# EAGLE design 01 (EAGLE 7.2.0)
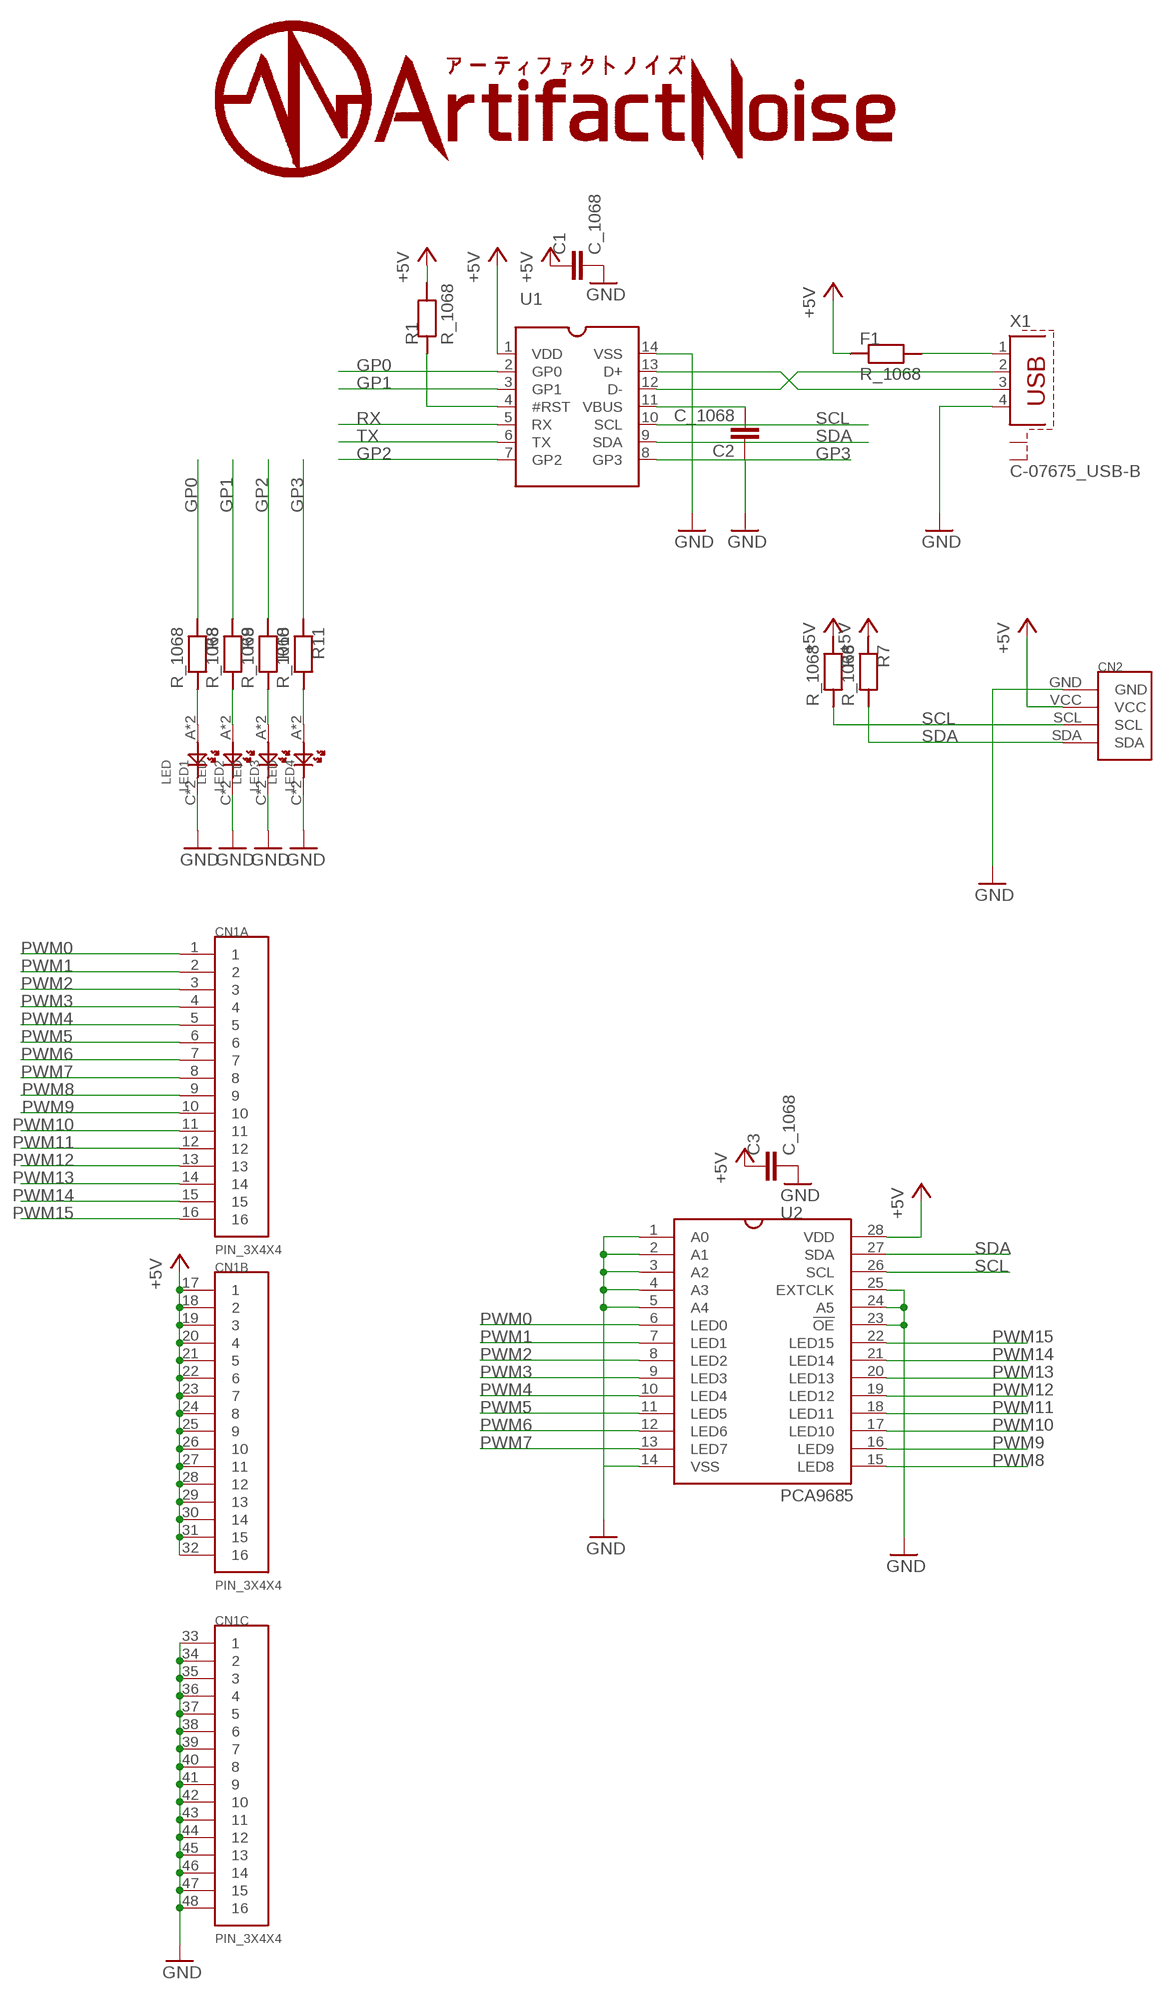
[diagram p0: schematic, sheet 1]

## Parts
C1  C_1068  [C0603]
C2  C_1068  [C0603]
C3  C_1068  [C0603]
CN1  PIN_3X4X4  [PIN_3X4X4]
CN2  PIN4  [PIN4]
F1  R_1068  [R0603]
LED1  LED  [CHIPLED_0805]
LED2  LED  [CHIPLED_0805]
LED3  LED  [CHIPLED_0805]
LED4  LED  [CHIPLED_0805]
R1  R_1068  [R0603]
R6  R_1068  [R0603]
R7  R_1068  [R0603]
R8  R_1068  [R0603]
R9  R_1068  [R0603]
R10  R_1068  [R0603]
R11  R_1068  [R0603]
U1  _MCP2221A-I/PS  [SOCKET-14]
U2  PCA9685  [TSSOP28]
X1  C-07675_USB-B  [PN61729-S]

## Nets
+5V: C1.1 C1.D1 C3.1 C3.D1 CN1.17 CN1.18 CN1.19 CN1.20 CN1.21 CN1.22 CN1.23 CN1.24 CN1.25 CN1.26 CN1.27 CN1.28 CN1.29 CN1.30 CN1.31 CN1.32 CN2.VCC F1.1 F1.D1 R1.2 R1.D2 R6.1 R6.D1 R7.1 R7.D1 U1.1(VDD) U2.28(VDD)
GND: C1.2 C1.D2 C2.1 C2.D1 C3.2 C3.D2 CN1.33 CN1.34 CN1.35 CN1.36 CN1.37 CN1.38 CN1.39 CN1.40 CN1.41 CN1.42 CN1.43 CN1.44 CN1.45 CN1.46 CN1.47 CN1.48 CN2.GND LED1.C LED1.DC(C) LED2.C LED2.DC(C) LED3.C LED3.DC(C) LED4.C LED4.DC(C) U1.14(VSS) U2.1(A0) U2.2(A1) U2.3(A2) U2.4(A3) U2.5(A4) U2.14(VSS) U2.23(!OE) U2.24(A5) U2.25(EXTCLK) X1.4
GP0: R8.1 R8.D1 U1.2(GP0)
GP1: R9.1 R9.D1 U1.3(GP1)
GP2: R10.1 R10.D1 U1.7(GP2)
GP3: R11.1 R11.D1 U1.8(GP3)
N$1: R1.1 R1.D1 U1.4(#RST)
N$2: U1.13(D+) X1.3
N$3: U1.12(D-) X1.2
N$4: C2.2 C2.D2 U1.11(VBUS)
N$5: F1.2 F1.D2 X1.1
N$9: LED1.A LED1.DA(A) R8.2 R8.D2
N$10: LED2.A LED2.DA(A) R9.2 R9.D2
N$11: LED3.A LED3.DA(A) R10.2 R10.D2
N$12: LED4.A LED4.DA(A) R11.2 R11.D2
PWM0: CN1.1 U2.6(LED0)
PWM1: CN1.2 U2.7(LED1)
PWM2: CN1.3 U2.8(LED2)
PWM3: CN1.4 U2.9(LED3)
PWM4: CN1.5 U2.10(LED4)
PWM5: CN1.6 U2.11(LED5)
PWM6: CN1.7 U2.12(LED6)
PWM7: CN1.8 U2.13(LED7)
PWM8: CN1.9 U2.15(LED8)
PWM9: CN1.10 U2.16(LED9)
PWM10: CN1.11 U2.17(LED10)
PWM11: CN1.12 U2.18(LED11)
PWM12: CN1.13 U2.19(LED12)
PWM13: CN1.14 U2.20(LED13)
PWM14: CN1.15 U2.21(LED14)
PWM15: CN1.16 U2.22(LED15)
RX: U1.5(RX)
SCL: CN2.SCL R6.2 R6.D2 U1.10(SCL) U2.26(SCL)
SDA: CN2.SDA R7.2 R7.D2 U1.9(SDA) U2.27(SDA)
TX: U1.6(TX)
Unconnected: X1.S1 X1.S2

## Library data of the parts
C1-C3 = 01:C_1068
CN1 = 01:PIN_3X4X4
CN2 = 01:PIN4
F1 R1 R6-R11 = 01:R_1068
LED1-LED4 = 01:LED
U1 = 01:_MCP2221A-I/P: Dual In Line / Socket
U2 = 01:PCA9685
X1 = 01:C-07675_USB-B: BERG USB connector; OC_FARNELL: unknown; OC_NEWARK: unknown

## Board
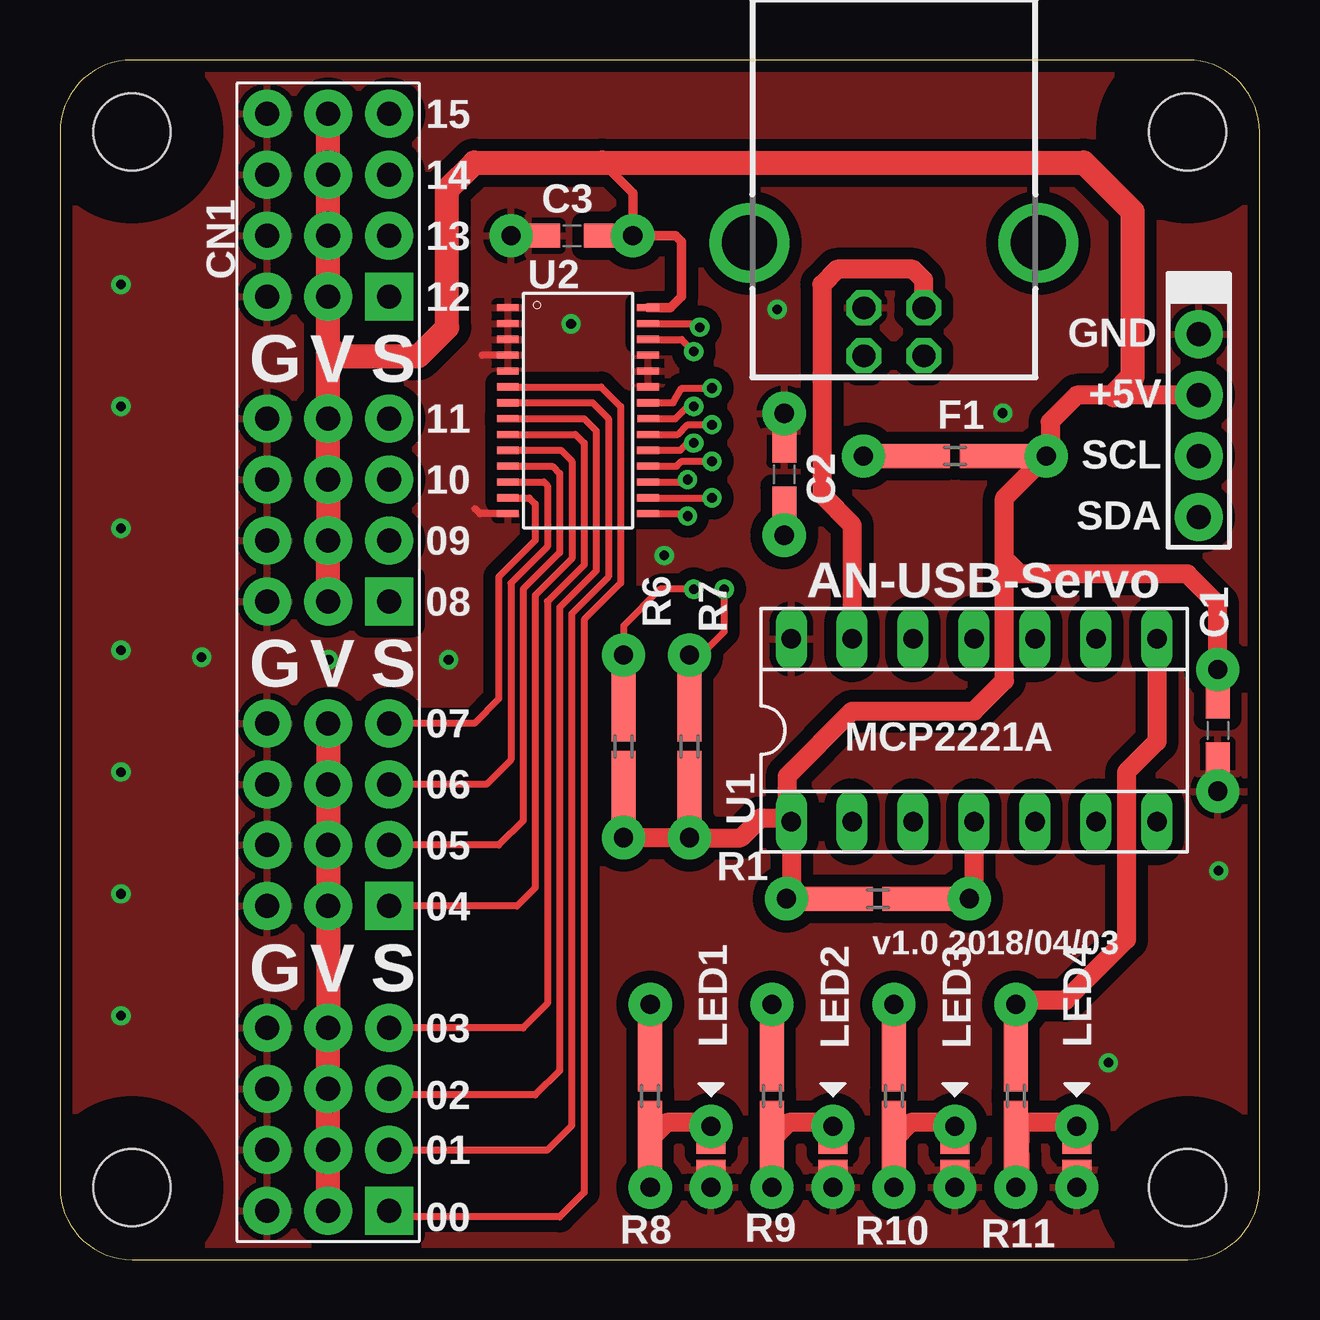
[diagram p1: board, top side]
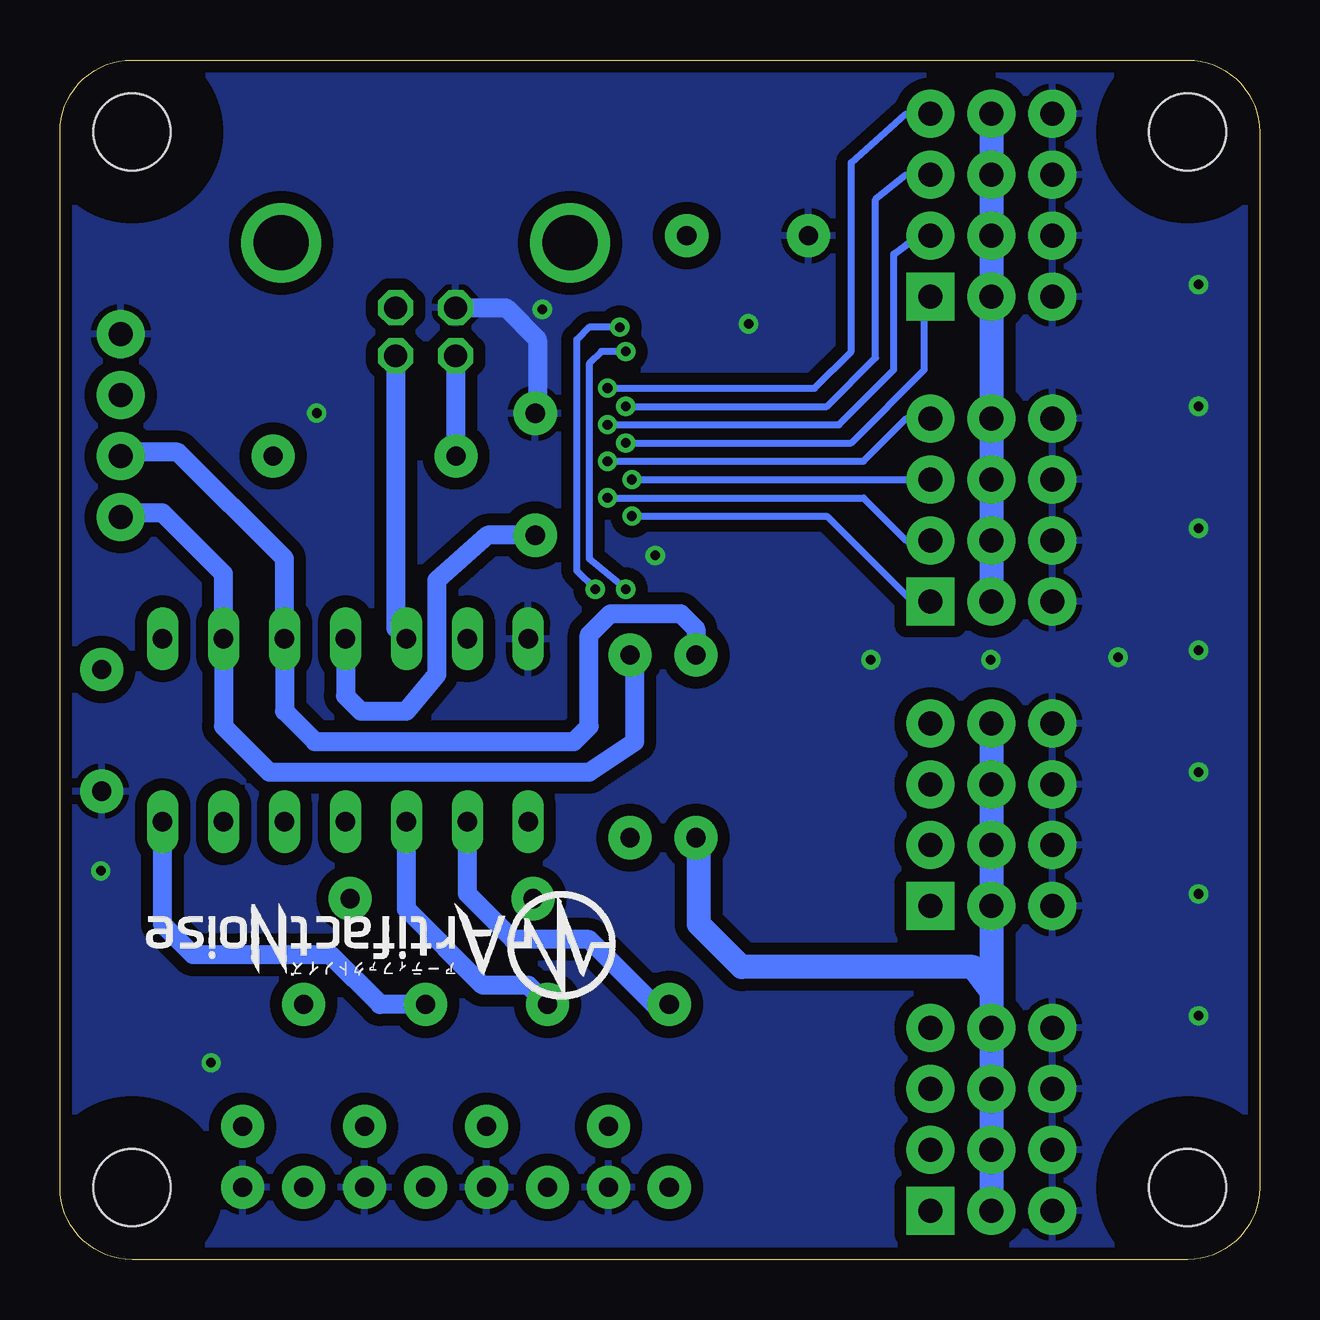
[diagram p2: board, bottom side, seen from below]

Size 50 x 50 mm. Coordinates in mm from the lower left corner, seen from the top.
Outline: 50,3 50,47 arc90 47,50 3,50 arc90 0,47 0,3 arc90 3,0 47,0 arc90 50,3
Copper layers (1*16): Top 0.035mm / dielectric 1.5mm / Bottom 0.035mm
Design rules "SeeedStudio_2layer_DRU_no_angle_20140221a": minimum track width 6mil, minimum drill 12mil, track to track 6mil, track to pad 6mil, pad to pad 6mil, via to via 6mil, smd to smd 0mil, copper to edge 10mil, drill to drill 10mil, minimum pad ring 10mil, minimum via ring 6mil, stop-mask expansion 2mil, vias tented up to drill 25mil, thermal gap 10mil
Holes 3.2 mm at 47,47 3,47 3,3 47,3
tRestrict: area -0.2,-0.2 to 6.2,6.2; area -0.2,43.8 to 6.2,50.2; area 43.8,43.8 to 50.2,50.2; area 43.8,-0.2 to 50.2,6.2
bRestrict: area 43.8,-0.2 to 50.2,6.2; area 43.8,43.8 to 50.2,50.2; area -0.2,43.8 to 6.2,50.2; area -0.2,-0.2 to 6.2,6.2

### Footprints (pad centres in the part's own frame; a part is rotated, then mirrored left to right if it is on the bottom)
C0603 = smd 2.6 x 1: 1 -1.8,0; 2 1.8,0 | drill 0.8 pad 1.8: D1 -2.54,0; D2 2.54,0
PIN_3X4X4 = drill 1 pad 2 square: 1 1.27,1.27; 5 13.97,1.27; 9 26.67,1.27; 13 39.37,1.27 | drill 1 pad 2: 2 3.81,1.27; 3 6.35,1.27; 4 8.89,1.27; 6 16.51,1.27; 7 19.05,1.27; 8 21.59,1.27; 10 29.21,1.27; 11 31.75,1.27; 12 34.29,1.27; 14 41.91,1.27; 15 44.45,1.27; 16 46.99,1.27; 17 1.27,3.81; 18 3.81,3.81; 19 6.35,3.81; 20 8.89,3.81; 21 13.97,3.81; 22 16.51,3.81; 23 19.05,3.81; 24 21.59,3.81; 25 26.67,3.81; 26 29.21,3.81; 27 31.75,3.81; 28 34.29,3.81; 29 39.37,3.81; 30 41.91,3.81; 31 44.45,3.81; 32 46.99,3.81; 33 1.27,6.35; 34 3.81,6.35; 35 6.35,6.35; 36 8.89,6.35; 37 13.97,6.35; 38 16.51,6.35; 39 19.05,6.35; 40 21.59,6.35; 41 26.67,6.35; 42 29.21,6.35; 43 31.75,6.35; 44 34.29,6.35; 45 39.37,6.35; 46 41.91,6.35; 47 44.45,6.35; 48 46.99,6.35
PIN4 = drill 1 pad 2: GND 0,-3.81; SCL 0,1.27; SDA 0,3.81; VCC 0,-1.27
R0603 = smd 3.2 x 1: 1 -1.8,0; 2 1.8,0 | drill 0.8 pad 1.8: D1 -3.81,0; D2 3.81,0
CHIPLED_0805 = smd 1.2 x 0.8: A 0,-1.8; C 0,-0.74 | drill 0.8 pad 1.8: DA 0,-2.54; DC 0,0
SOCKET-14 = drill 0.813 long: 1 -7.62,-3.81; 2 -5.08,-3.81; 3 -2.54,-3.81; 4 0,-3.81; 5 2.54,-3.81; 6 5.08,-3.81; 7 7.62,-3.81; 8 7.62,3.81; 9 5.08,3.81; 10 2.54,3.81; 11 0,3.81; 12 -2.54,3.81; 13 -5.08,3.81; 14 -7.62,3.81
TSSOP28 = smd 0.9 x 0.3: 1 -2.921,4.623; 2 -2.921,3.962; 3 -2.921,3.302; 4 -2.921,2.642; 5 -2.921,1.981; 6 -2.921,1.321; 7 -2.921,0.66; 8 -2.927,0; 9 -2.921,-0.66; 10 -2.921,-1.321; 11 -2.921,-1.981; 12 -2.921,-2.642; 13 -2.921,-3.302; 14 -2.921,-3.962; 15 2.921,-3.962; 16 2.921,-3.302; 17 2.921,-2.642; 18 2.921,-1.981; 19 2.921,-1.321; 20 2.921,-0.66; 21 2.927,0; 22 2.921,0.66; 23 2.921,1.321; 24 2.921,1.981; 25 2.921,2.642; 26 2.921,3.302; 27 2.921,3.962; 28 2.921,4.623
PN61729-S = drill 0.95 octagon: 1 1.25,4.71; 2 -1.25,4.71; 3 -1.25,2.71; 4 1.25,2.71 | drill 2.3 pad 2.9: S1 -6.02,0; S2 6.02,0

### Placement (x,y rotation side)
C1  48.26,22.06 270 top
C2  30.19,32.73 270 top
C3  21.34,42.67 180 top
CN1  14.99,0.76 90 top
CN2  47.46,34.76 180 top
F1  37.3,33.49 180 top
LED1  27.14,3.01 180 top
LED2  32.22,3.01 180 top
LED3  37.3,3.01 180 top
LED4  42.38,3.01 180 top
R1  34.09,15.04 180 top
R6  23.5,21.39 90 top
R7  26.23,21.39 90 top
R8  24.6,6.82 270 top
R9  29.68,6.82 270 top
R10  34.76,6.82 270 top
R11  39.84,6.82 270 top
U1  38.1,22.06 0 top
U2  21.59,35.05 0 top
U$1  [AN-LOGO2]  26.85,15.34 180 bottom
X1  34.76,42.38 180 top

### Tracks (layer width: path | path; a pad name or v marks a point on that pad's centre or on a via)
+5V
  Top 0.4: U2.28 25.45,39.67 25.91,40.13 25.91,42.42 25.65,42.67 C3.D1 | C3.D1 23.88,44.45 22.61,45.72 | C3.1 C3.D1
  Top 0.406: R6.1 R6.D1 | R7.1 R7.D1 | R1.2 R1.D2
  Top 0.8: F1.1 F1.D1 | CN2.VCC 43.94,36.03 42.38,36.03 41.27,34.92 41.27,33.66 F1.D1 | R1.D2 30.48,15.24 U1.1 30.32,18.41 | R6.D1 R7.D1 28.38,17.58 29.21,18.41 30.32,18.41 | C1.1 C1.D1 48.26,27.3 46.99,28.57 40.01,28.57 39.37,29.21 | 30.32,18.41 30.32,20.16 33.02,22.86 38.1,22.86 39.37,24.13 39.37,29.21 | 39.37,29.21 39.37,31.75 F1.D1
  Top 1: 43.94,36.03 44.7,36.79 44.7,43.69 42.67,45.72 22.61,45.72 17.27,45.72 16.14,44.59 16.14,38.85 14.92,37.64 11.7,37.64 11.18,38.06 | CN1.17 CN1.18 CN1.19 CN1.20 CN1.21 CN1.22 CN1.23 CN1.24 | CN1.25 CN1.26 CN1.27 CN1.28 11.18,38.06 | 11.18,38.06 CN1.29 CN1.30 CN1.31 CN1.32
  Bottom 1: 11.18,11.18 11.94,12.19 21.59,12.19 23.37,13.97 23.37,17.45 R6.D1 | CN1.32 CN1.31 CN1.30 CN1.29 CN1.25 | CN1.24 11.18,11.18 | 11.18,11.18 CN1.20 CN1.17
GND  (via drill 0.4 pad 0.8)
  Top 0.3: U2.4 17.61,37.69 17.6,37.7 | U2.14 17.51,31.09 17.3,31.3
  Top 0.8: LED4.C LED4.DC
  Bottom 0.8: X1.4 31.41,39.67 30.1,38.35 30.1,35.18 C2.D1
  other vias: 2.54,40.64 2.54,35.56 2.54,30.48 2.54,25.4 2.54,20.32 2.54,15.24 2.54,10.16 11.2,25 16.2,25 5.9,25.1 21.3,39 29.9,39.6 25.18,29.35 43.7,8.2 48.3,16.2 39.3,35.28
  pour Top (isolate 0.5): 51.27,-0.8 -0.8,-0.8 -0.8,51.27 51.27,51.27
  pour Bottom (isolate 0.5): 51.27,-0.8 -0.8,-0.8 -0.8,51.27 51.27,51.27
GP0
  Top 0.406: R8.1 R8.D1
  Bottom 0.8: R8.D1 25.23,10.63 27.94,13.34 31.11,13.34 33.02,15.24 U1.2
GP1
  Top 0.406: R9.1 R9.D1
  Bottom 0.8: R9.D1 30.48,11.43 32.38,11.43 35.56,14.61 U1.3
GP2
  Top 0.406: R10.1 R10.D1
  Bottom 0.8: R10.D1 36.66,10.63 38.73,12.7 44.45,12.7 45.72,13.97 U1.7
GP3
  Top 0.406: R11.1 R11.D1
  Top 0.8: U1.8 45.72,21.59 44.45,20.32 44.45,13.34 41.91,10.79 40.01,10.79 R11.D1
N$1
  Top 0.406: R1.1 R1.D1
  Top 0.8: U1.4 38.1,15.24 R1.D1
N$2
  Top 0.8: X1.3 36.01,40.83 35.56,41.27 32.38,41.27 31.75,40.64 31.75,31.88 33.02,30.61 U1.13
N$3
  Bottom 0.8: X1.2 36.01,26.32 U1.12
N$4
  Top 0.406: C2.D2 C2.2
  Bottom 0.8: U1.11 38.1,23.5 37.47,22.86 35.56,22.86 34.29,24.38 34.29,28.32 32.17,30.19 C2.D2
N$5
  Top 0.8: F1.D2 F1.2
  Bottom 0.8: X1.1 33.51,33.51 F1.D2
N$9
  Top 0.8: LED1.A LED1.DA 27.3,5.71 25.3,5.71 R8.2 R8.D2
N$10
  Top 0.8: LED2.A LED2.DA 32.38,5.71 30.38,5.71 R9.2 R9.D2
N$11
  Top 0.8: LED3.A LED3.DA 37.47,5.71 35.45,5.71 R10.2 34.76,3.98 34.92,3.17 R10.D2
N$12
  Top 0.8: LED4.A LED4.DA 42.55,5.71 40.01,5.71 40.01,4.86 | R11.D2 40.01,3.17 40.01,4.45 40.01,4.86 | 40.01,4.86 R11.2
PWM0
  Top 0.3: U2.6 22.55,36.37 23.37,35.56 23.37,28.19 21.84,26.67 21.84,2.79 20.83,1.78 13.97,1.78 CN1.1
PWM1
  Top 0.3: CN1.2 20.32,4.57 21.34,5.59 21.34,26.92 22.86,28.45 22.86,35.05 22.2,35.71 U2.7
PWM2
  Top 0.3: U2.8 21.84,35.05 22.35,34.54 22.35,28.7 20.83,27.18 20.83,7.87 19.81,6.86 13.97,6.86 CN1.3
PWM3
  Top 0.3: U2.9 21.49,34.39 21.84,34.04 21.84,28.96 20.32,27.43 20.32,10.67 19.3,9.65 CN1.4
PWM4
  Top 0.3: U2.10 20.88,33.73 21.34,33.27 21.34,29.21 19.81,27.69 19.81,15.49 19.05,14.73 CN1.5
PWM5
  Top 0.3: U2.11 20.52,33.07 20.83,32.77 20.83,29.46 19.3,27.94 19.3,18.29 18.29,17.27 CN1.6
PWM6
  Top 0.3: U2.12 20.17,32.41 20.32,32.26 20.32,29.72 18.8,28.19 18.8,20.83 17.78,19.81 CN1.7
PWM7
  Top 0.3: U2.13 19.56,31.75 19.81,31.5 19.81,29.97 18.29,28.45 18.29,23.37 17.27,22.35 CN1.8
PWM8  (via drill 0.4 pad 0.8)
  Top 0.3: U2.15 26.06,31.09 v26.16,30.99
  Bottom 0.3: v26.16,30.99 18.03,30.99 14.48,27.43 CN1.9
PWM9  (via drill 0.4 pad 0.8)
  Top 0.3: U2.16 v27.18,31.75
  Bottom 0.3: v27.18,31.75 16.51,31.75 14.73,29.97 CN1.10
PWM10  (via drill 0.4 pad 0.8)
  Top 0.3: U2.17 26.31,32.41 v26.16,32.51
  Bottom 0.3: v26.16,32.51 CN1.11
PWM11  (via drill 0.4 pad 0.8)
  Top 0.3: U2.18 25.7,33.07 25.91,33.27 v27.18,33.27
  Bottom 0.3: v27.18,33.27 16.51,33.27 14.73,35.05 CN1.12
PWM12  (via drill 0.4 pad 0.8)
  Top 0.3: U2.19 25.86,33.73 26.16,34.04 v26.42,34.04
  Bottom 0.3: v26.42,34.04 17.02,34.04 13.97,37.08 13.97,39.37 13.72,39.88 CN1.13
PWM13  (via drill 0.4 pad 0.8)
  Top 0.3: U2.20 25.76,34.39 26.16,34.8 v27.18,34.8
  Bottom 0.3: v27.18,34.8 17.53,34.8 15.24,37.08 15.24,41.91 14.22,42.67 CN1.14
PWM14  (via drill 0.4 pad 0.8)
  Top 0.3: U2.21 25.65,35.05 26.16,35.56 v26.42,35.56
  Bottom 0.3: v26.42,35.56 18.03,35.56 16,37.59 16,44.2 14.73,45.21 CN1.15
PWM15  (via drill 0.4 pad 0.8)
  Top 0.3: U2.22 25.55,35.71 25.91,36.32 v27.18,36.32
  Bottom 0.3: v27.18,36.32 18.54,36.32 17.02,37.85 17.02,45.72 14.73,47.75 CN1.16
SCL  (via drill 0.4 pad 0.8)
  Top 0.3: U2.26 25.91,38.35 v26.42,37.85 | v26.42,27.94 25.02,27.94 23.5,26.42 R6.D2
  Top 0.406: R6.2 R6.D2
  Bottom 0.3: v26.42,37.85 27.43,37.85 27.94,37.34 27.94,29.21 v26.42,27.94
  Bottom 0.8: R6.D2 23.5,26.29 24.13,26.92 27.05,26.92 27.94,26.04 27.94,22.23 28.57,21.59 39.37,21.59 40.64,22.86 U1.10 40.64,29.21 45.09,33.66 47.3,33.66 CN2.SCL
SDA  (via drill 0.4 pad 0.8)
  Top 0.3: U2.27 26.52,39.01 v26.67,38.86 | v27.69,27.94 27.69,26.16 26.67,25.15 26.29,25.15 R7.D2
  Top 0.406: R7.2 R7.D2
  Bottom 0.3: v26.67,38.86 27.94,38.86 28.45,38.35 28.45,28.7 v27.69,27.94
  Bottom 0.8: CN2.SDA 47.3,31.11 45.72,31.11 43.18,28.57 U1.9 43.18,22.23 41.27,20.32 27.94,20.32 26.04,21.59 26.04,25 R7.D2

### Text on the board
tPlace: 15 | 14 | 13 | 12 | GND | G | V | S | +5V | 11 | SCL | 10 | SDA | 09 | AN-USB-Servo | 08 | G | V | S | 07 | MCP2221A | 06 | 05 | 04 | v1.0 2018/04/03 | G | V | S | 03 | 02 | 01 | 00